# Altium schematic sheet Sheet1.SchDoc
size A4; SheetNumber: 1; SheetTotal: 1
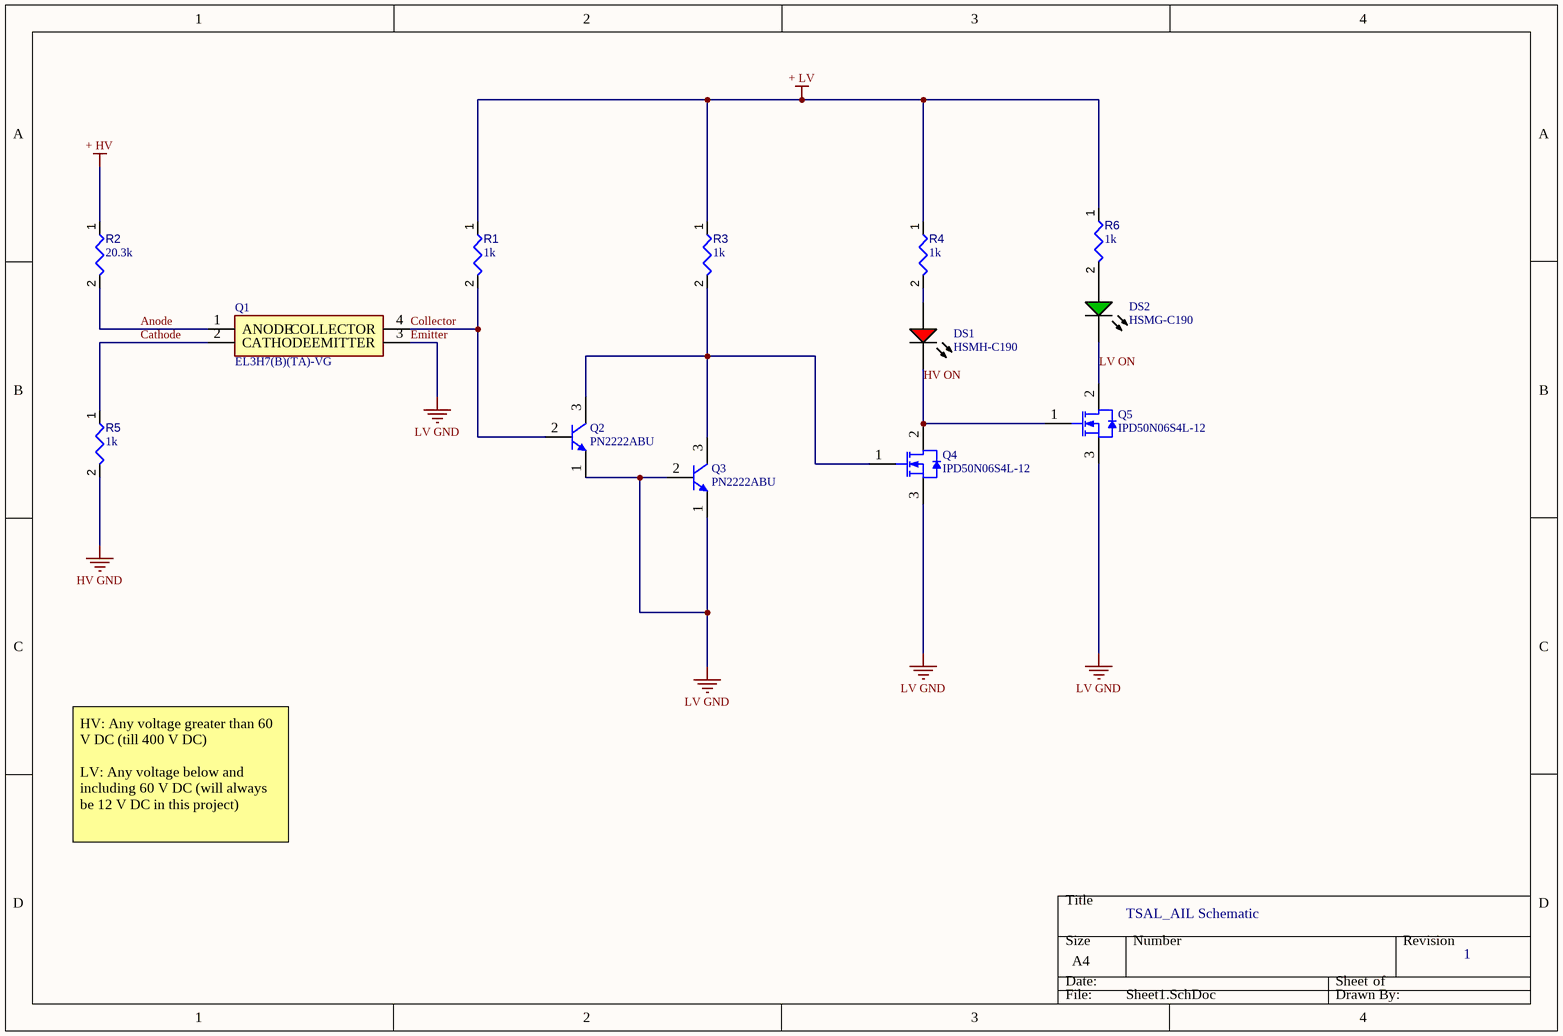
[diagram p0: Sheet1.SchDoc]

## Parts
DS1  HSMH-C190  [AVAG-HSMX-C190_V]
DS2  HSMG-C190  [AVAG-HSMX-C190_V]
Q1  EL3H7(B)(TA)-VG  [SOIC127P700X200-4N]
Q2  PN2222ABU  [FAIR-TO-92]
Q3  PN2222ABU  [FAIR-TO-92]
Q4  IPD50N06S4L-12  [INF-PG-TO252-3-11_M]
Q5  IPD50N06S4L-12  [INF-PG-TO252-3-11_M]
R1  value 1k  [RESC0402(1005)_L]  (hidden comment: Resistor 84K5 +/-1 % 0402 63 mW)
R2  value 20.3k  [RESC0402(1005)_L]  (hidden comment: Resistor 84K5 +/-1 % 0402 63 mW)
R3  value 1k  [RESC0402(1005)_L]  (hidden comment: Resistor 84K5 +/-1 % 0402 63 mW)
R4  value 1k  [RESC0402(1005)_L]  (hidden comment: Resistor 84K5 +/-1 % 0402 63 mW)
R5  value 1k  [RESC0402(1005)_L]  (hidden comment: Resistor 84K5 +/-1 % 0402 63 mW)
R6  value 1k  [RESC0402(1005)_L]  (hidden comment: Resistor 84K5 +/-1 % 0402 63 mW)

## Nets
+ HV: R2.1
+ LV: R1.1 R3.1 R4.1 R6.1
Emitter: Q1.3(EMITTER) Q2.1(E) Q3.1(E) Q3.2(B) Q4.3(SOURCE) Q5.3(SOURCE)  [also labelled LV GND]
HV GND: R5.2
Anode: Q1.1(ANODE) R2.2
Cathode: Q1.2(CATHODE) R5.1
Collector: Q1.4(COLLECTOR) Q2.2(B) R1.2
HV ON: DS1.2(K) Q4.2(DRAIN) Q5.1(GATE)
LV ON: DS2.2(K) Q5.2(DRAIN)
NetDS1_1: DS1.1(A) R4.2
NetDS2_1: DS2.1(A) R6.2
NetQ2_3: Q2.3(C) Q3.3(C) Q4.1(GATE) R3.2

## Notes on the sheet
- HV: Any voltage greater than 60 V DC (till 400 V DC)
  LV: Any voltage below and including 60 V DC (will always be 12 V DC in this project)
- TSAL_AIL Schematic
- 1

## Library data of the parts
DS1 = CMP-007-00014-2: LED Uni-Color Red, 65 mW, 20 mA, -40 to 85 degC, 2-Pin SMD, RoHS, Tape and Reel; Manufacturer: Avago; Nominal Vf: 1.8V; Luminous Intensity: 17mcd; Power: 78mW; Forward Current: 20mA; Lens Style: Diffused; Viewing Angle: 170degrees; Package Quantity: 4000; Colour: Red; Manufacturer URL: http://www.avagotech.com/; Min Operating Temperature: -40°C; Datasheet URL: http://docs.avagotech.com/docs/AV02-0551EN; RoHS Compliant: True; Forward Voltage: 1.8V; Pins: 2; Max Operating Temperature: 85°C; Packaging: TapeandReel; Package Reference: HSMX-C190; Datasheet Version: Mar-12; Package Description: 2-Pin Surface Mount Device, Body 1.6 x 0.8 mm, Height 0.9 mm; Case/Package: 0603; Mounting Technology: SM; Illumination Colour: Red
DS2 = CMP-007-00013-2: LED Uni-Color Green, 52 mW, 20 mA, -40 to 85 degC, 2-Pin SMD, RoHS, Tape and Reel; Manufacturer: Avago; Forward Current: 20mA; Viewing Angle: 170degrees; Luminous Intensity: 15mcd; Lens Style: Diffused; Forward Voltage: 2.2V; Power: 52mW; Mounting Technology: SM; RoHS Compliant: True; Packaging: TapeandReel; Illumination Colour: Green; Datasheet URL: http://docs.avagotech.com/docs/AV02-0551EN; Min Operating Temperature: -40°C; Max Operating Temperature: 85°C; Pins: 2; Package Description: 2-Pin Surface Mount Device, Body 1.6 x 0.8 mm, Height 0.9 mm; Nominal Vf: 2.2V; Case/Package: 0603; Manufacturer URL: http://www.avagotech.com/; Datasheet Version: Mar-12; Colour: Green; Package Reference: HSMX-C190; Package Quantity: 4000
Q1 = EL3H7_B__TA_-VG: Phototransistor; Manufacturer_Name: Everlight; Datasheet Link: https://everlightamericas.com/index.php?controller=attachment&id_attachment=2584; Height: 2mm; Manufacturer_Part_Number: EL3H7(B)(TA)-VG; Mouser Part Number: 638-EL3H7BTAVG; Mouser Price/Stock: https://www.mouser.co.uk/ProductDetail/Everlight/EL3H7BTA-VG?qs=8PzhAHr7IdPwN0NTF4wcmQ%3D%3D; Arrow Part Number: EL3H7(B)(TA)-VG; Arrow Price/Stock: https://www.arrow.com/en/products/el3h7-b-ta-vg/everlight-electronics?region=nac
Q2 Q3 = CMP-013-00009-3: NPN General-Purpose Amplifier, 40 V, -55 to 150 degC, 3-Pin TO-92, RoHS, Bulk; Manufacturer: Fairchild; Power: 625mW; Elements: 1; hFE Min: 100; Vce Max: 1V; Frequency: 300MHz; Mounting Technology: TH; Package Quantity: 1000; RoHS Compliant: True; Datasheet Version: Rev. 1.1.0, 07/2014; Max Operating Temperature: 150°C; Min Operating Temperature: -55°C; Package Reference: TO-92; Package Description: 3-Pin Transistor Outline Package, Body Dia 4.79 mm, Pitch 1.27 mm; Pins: 3; Packaging: Bulk; Datasheet URL: https://www.fairchildsemi.com/datasheets/PN/PN2222A.pdf; Case/Package: TO-226-3
Q4 Q5 = CMP-1138-00106-1: OptiMOS-T2 Power-Transistor, 60 V VDS, 50 A ID, PG-TO252-3-11, Reel, Green; Manufacturer: Infineon; QG: 30 nC; RDS (on) (max) (@10V): 12 mOhm; VGS(th) (max): 2.2 V; VGS(th) (min): 1.2 V; Ptot (max): 50 W; RDS (on) (max) (@4.5V): 21.6 mOhm; ID (max): 50 A; RthJC (max): 3 K/W; VDS (max): 60 V; IDpuls (max): 200 A; Green: TRUE; ComponentLink1URL: http://www.infineon.com/; ComponentLink3URL: http://www.infineon.com/dgdl/BTS142_DS_13.pdf?folderId=db3a3043163797a6011667aa084c0e01&fileId=db3a3043163797a6011667ac98be0e02&location=en.Products.Automotive_ICs.Smart_High-_and_Low-Side_Switches.HITFET___TEMPFET__-_Smart_Low-Side_Switches.DATASHEET.BTS1; ComponentLink2URL: http://www.infineon.com/dgdl/IPD50N06S4L-12_DS_10.pdf?folderId=db3a30431a5c32f2011a8084a04a6500&fileId=db3a30431ff9881501203885cc580ca0&location=en.Products.Automotive_ICs.Automotive_MOSFETs.Single__N-Channel_60V_MOSFETs.DATASHEET.IPD50N06S4L-12_DS_10.pdf; DatasheetVersion: Rev. 1.0; Packing: Reel; ComponentLink2Description: Datasheet; Mounting Technology: Surface Mount; Technology: OptiMOS-T2; PackageVersion: Dec-06; ComponentLink3Description: Package Specification; PackageReference: PG-TO252-3-11; PartNumber: IPD50N06S4L-12; Halogen-free: TRUE; PackageDescription: 3-Pin Plastic (Green) Transistor Single Outline Package, 6.5 x 6.12 mm Body, 2.28 mm Pitch; ComponentLink1Description: Manufacturer URL
R1-R6 = CMP-009-00130-3: Chip Resistor, 84,5 kOhms, +/-1 %, 63 mW, -55 to 155 degC, 0402; Tolerance: 1%; Power: 63mW; Max Operating Temperature: 155°C; Min Operating Temperature: -55°C; Case/Package: 0402; Pins: 2